# EAGLE schematic Main (EAGLE 9.6.2)
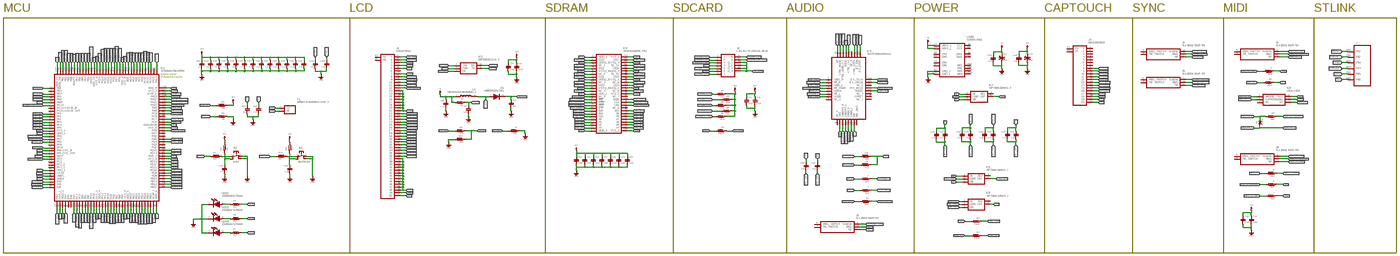
[diagram p0: schematic, sheet 1, overview]
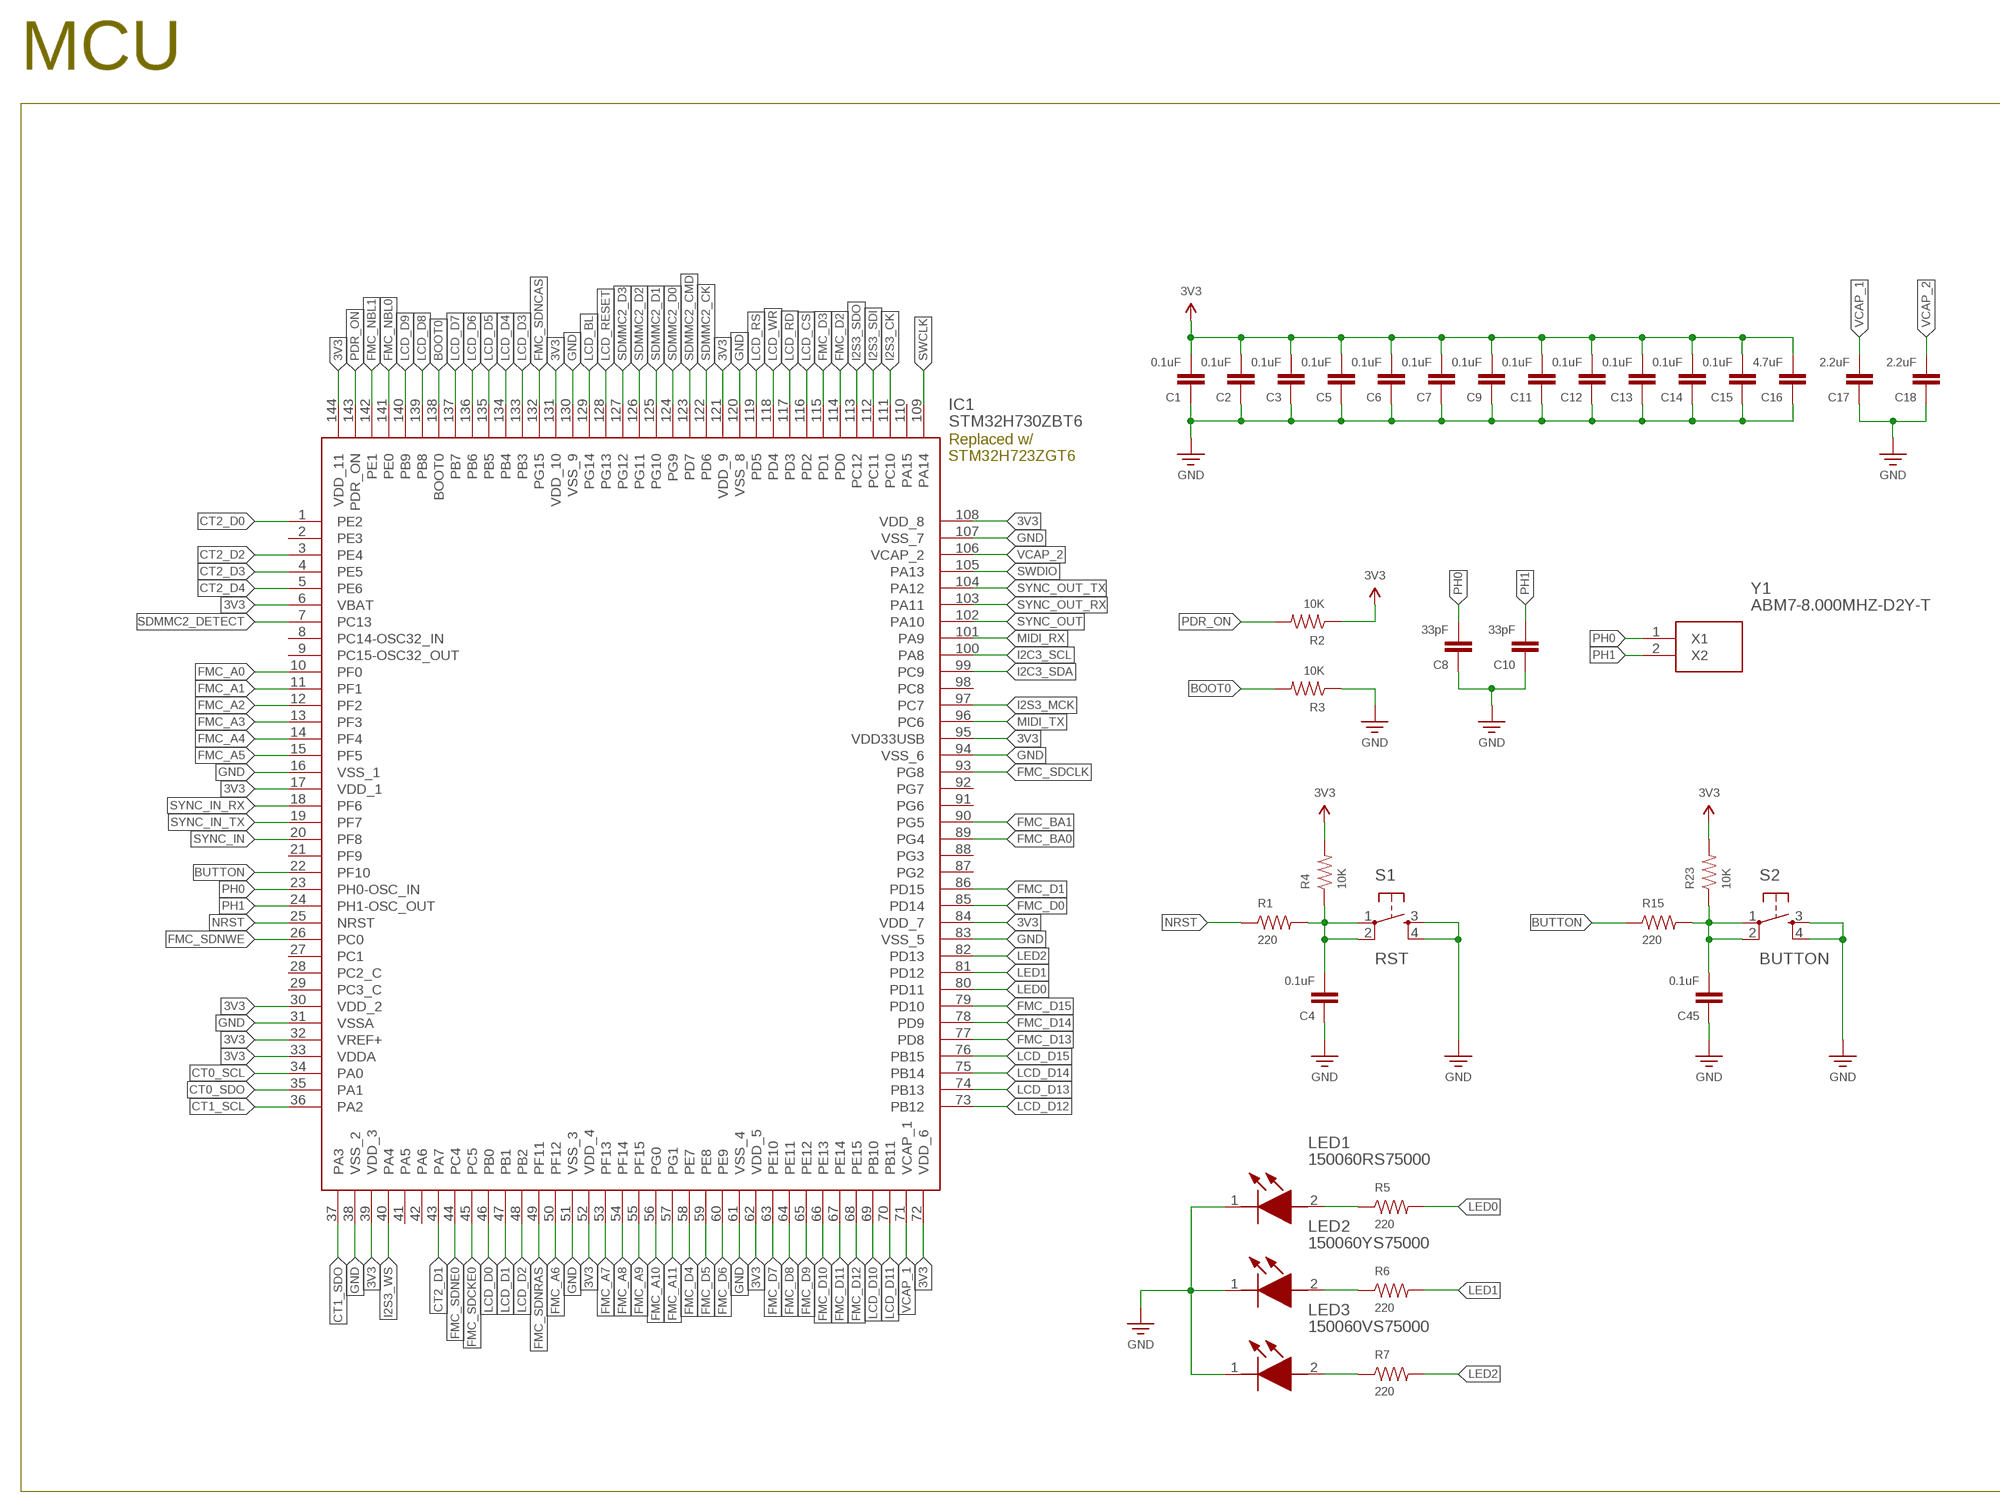
[diagram p1: schematic, sheet 1, part 1 of 4]
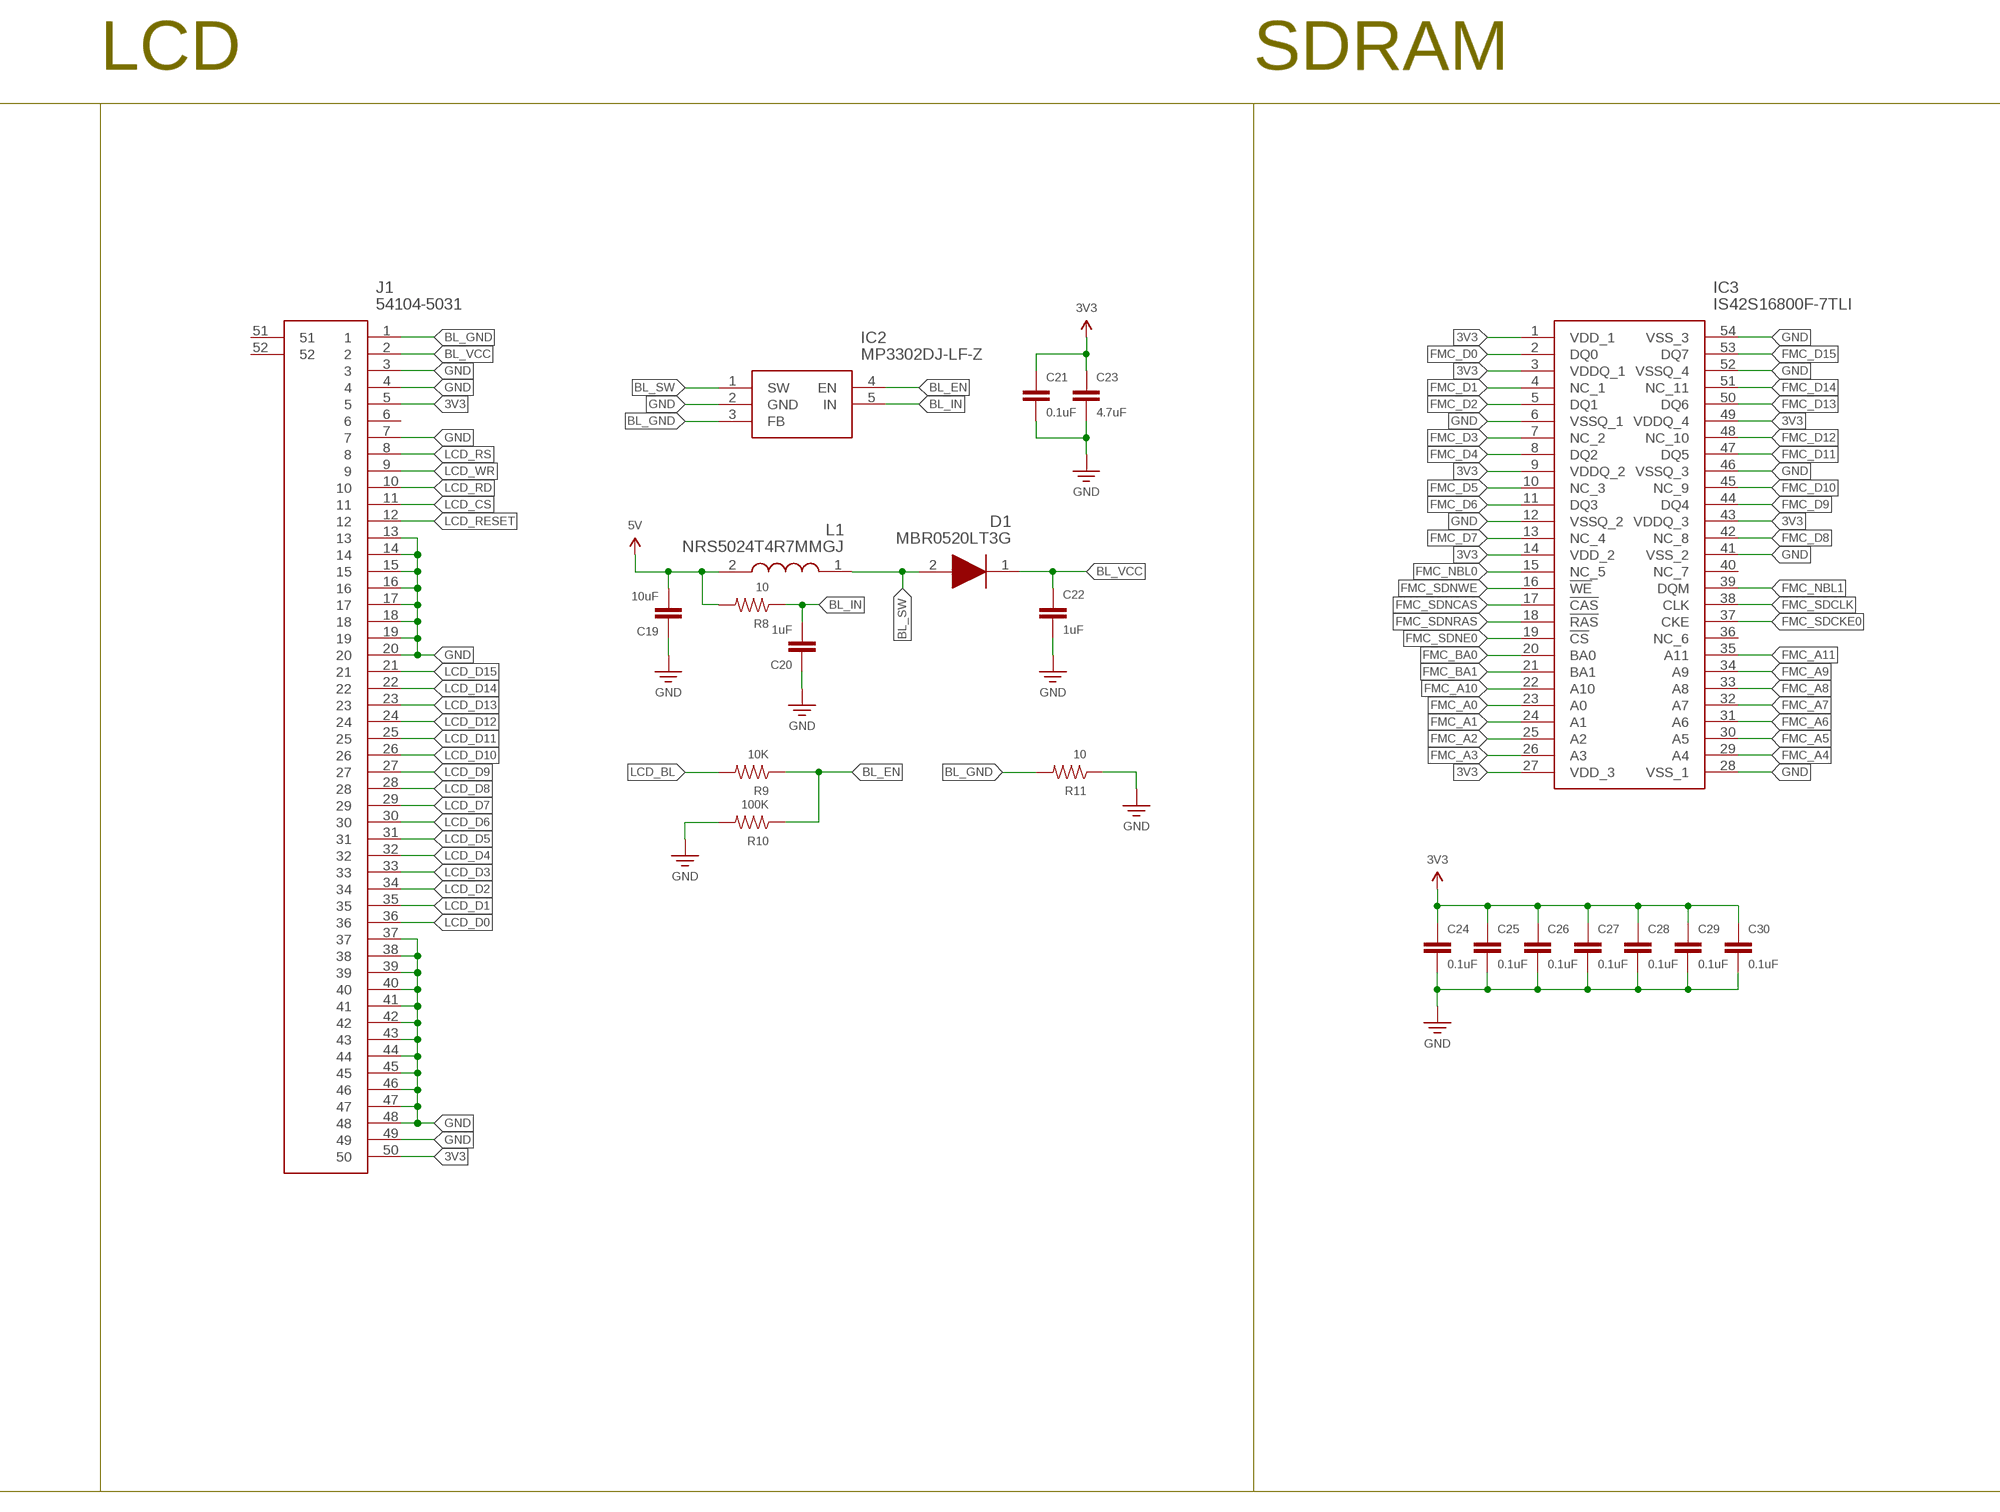
[diagram p2: schematic, sheet 1, part 2 of 4]
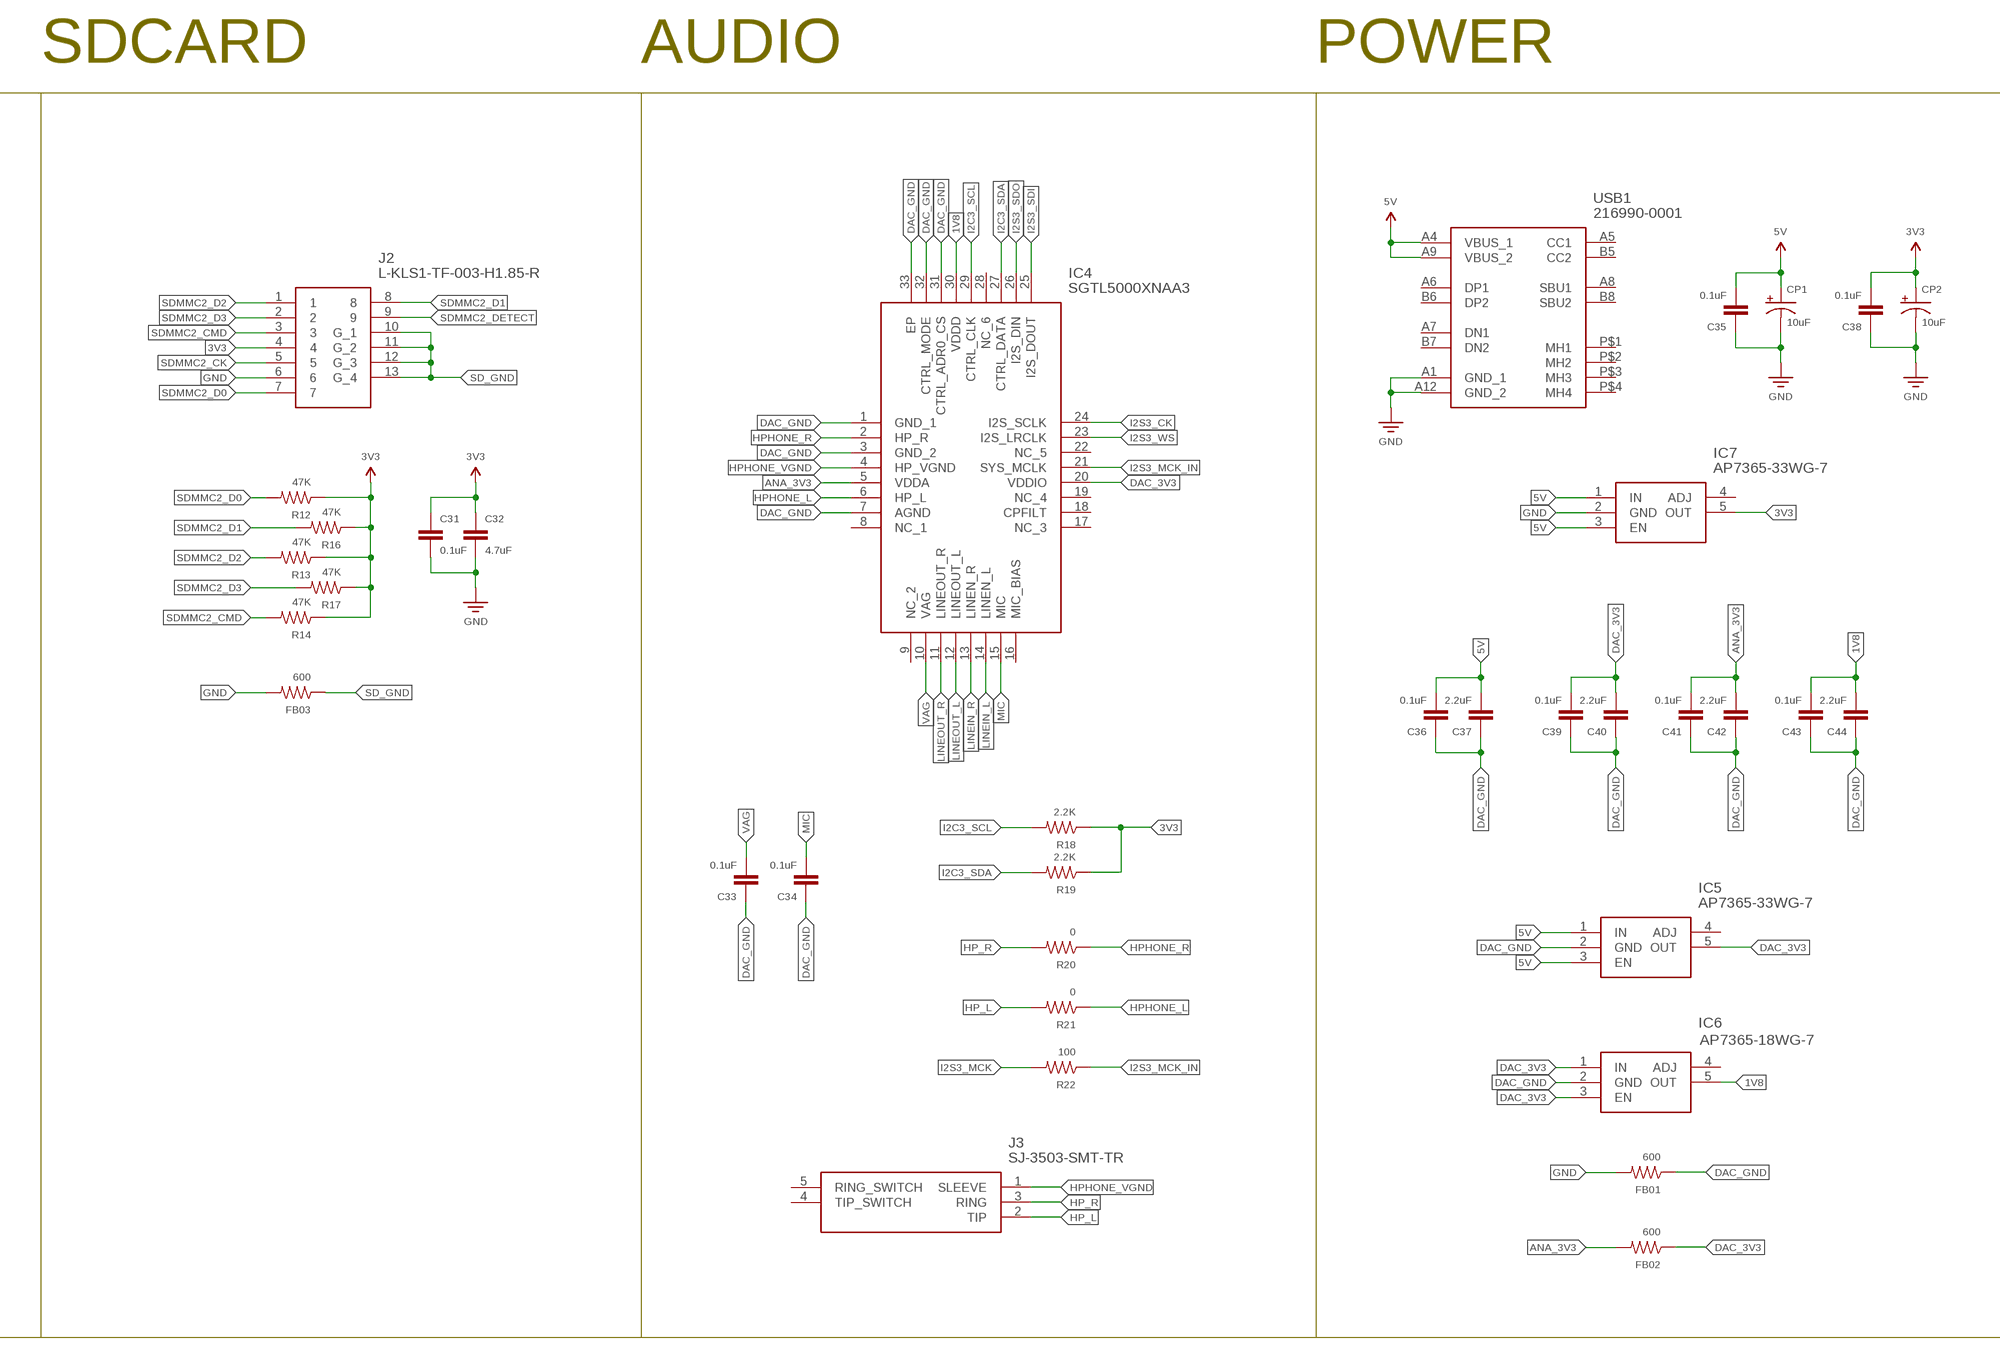
[diagram p3: schematic, sheet 1, part 3 of 4]
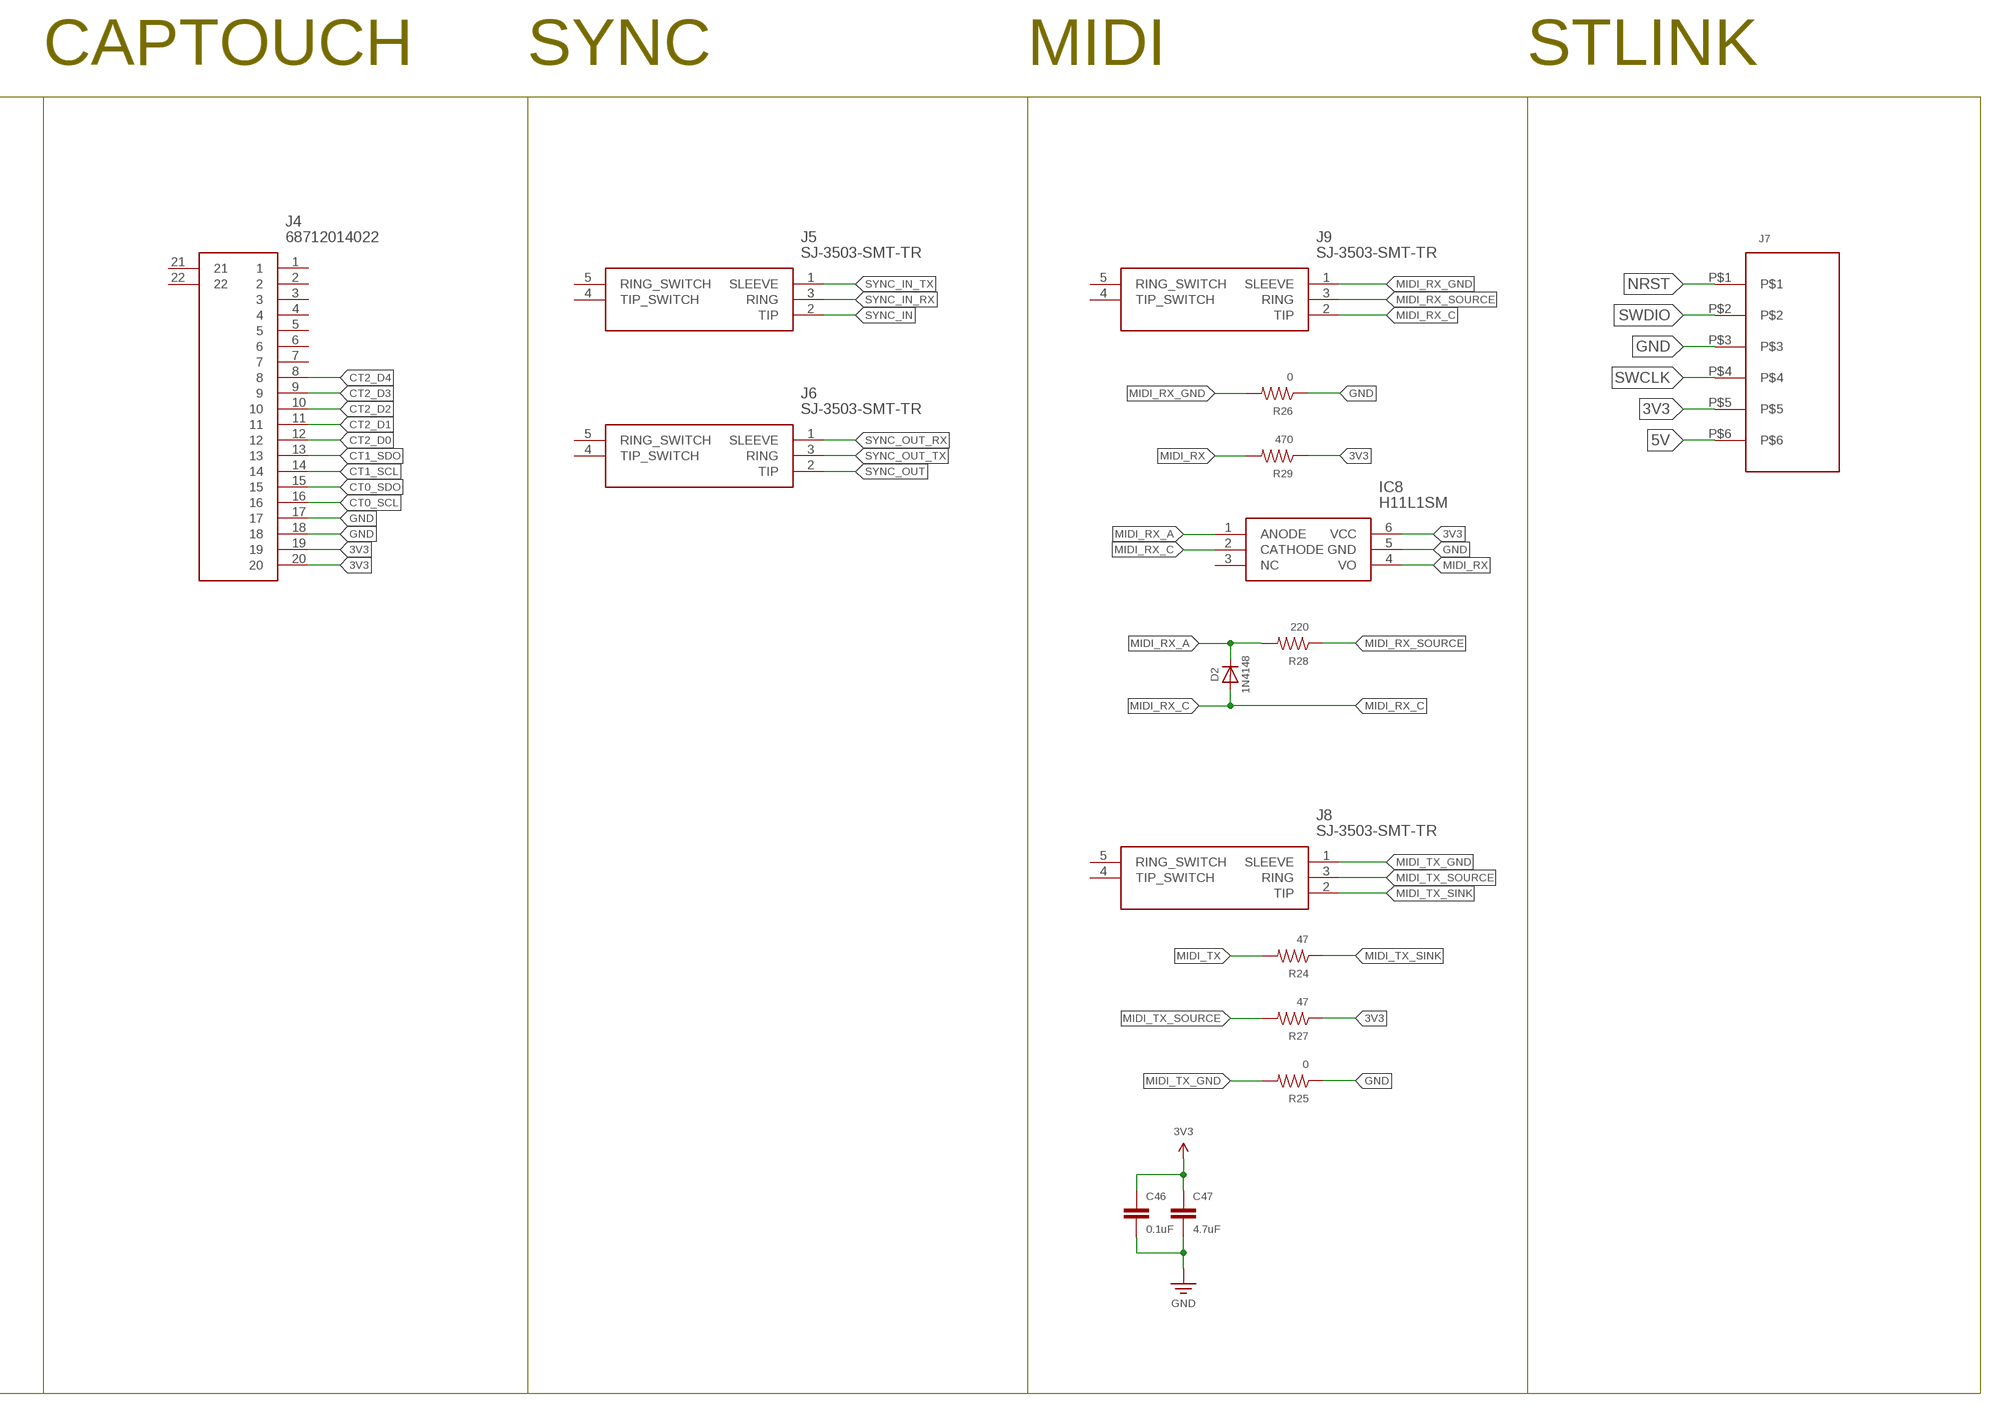
[diagram p4: schematic, sheet 1, part 4 of 4]

## Parts
C1  0.1uF  CAP-0603  [CAP-0603]
C2  0.1uF  CAP-0603  [CAP-0603]
C3  0.1uF  CAP-0603  [CAP-0603]
C4  0.1uF  CAP-0603  [CAP-0603]
C5  0.1uF  CAP-0603  [CAP-0603]
C6  0.1uF  CAP-0603  [CAP-0603]
C7  0.1uF  CAP-0603  [CAP-0603]
C8  33pF  CAP-0603  [CAP-0603]
C9  0.1uF  CAP-0603  [CAP-0603]
C10  33pF  CAP-0603  [CAP-0603]
C11  0.1uF  CAP-0603  [CAP-0603]
C12  0.1uF  CAP-0603  [CAP-0603]
C13  0.1uF  CAP-0603  [CAP-0603]
C14  0.1uF  CAP-0603  [CAP-0603]
C15  0.1uF  CAP-0603  [CAP-0603]
C16  4.7uF  CAP-0603  [CAP-0603]
C17  2.2uF  CAP-0603  [CAP-0603]
C18  2.2uF  CAP-0603  [CAP-0603]
C19  10uF  CAP-0603  [CAP-0603]
C20  1uF  CAP-0603  [CAP-0603]
C21  0.1uF  CAP-0603  [CAP-0603]
C22  1uF  CAP-0603  [CAP-0603]
C23  4.7uF  CAP-0603  [CAP-0603]
C24  0.1uF  CAP-0603  [CAP-0603]
C25  0.1uF  CAP-0603  [CAP-0603]
C26  0.1uF  CAP-0603  [CAP-0603]
C27  0.1uF  CAP-0603  [CAP-0603]
C28  0.1uF  CAP-0603  [CAP-0603]
C29  0.1uF  CAP-0603  [CAP-0603]
C30  0.1uF  CAP-0603  [CAP-0603]
C31  0.1uF  CAP-0603  [CAP-0603]
C32  4.7uF  CAP-0603  [CAP-0603]
C33  0.1uF  CAP-0603  [CAP-0603]
C34  0.1uF  CAP-0603  [CAP-0603]
C35  0.1uF  CAP-0603  [CAP-0603]
C36  0.1uF  CAP-0603  [CAP-0603]
C37  2.2uF  CAP-0603  [CAP-0603]
C38  0.1uF  CAP-0603  [CAP-0603]
C39  0.1uF  CAP-0603  [CAP-0603]
C40  2.2uF  CAP-0603  [CAP-0603]
C41  0.1uF  CAP-0603  [CAP-0603]
C42  2.2uF  CAP-0603  [CAP-0603]
C43  0.1uF  CAP-0603  [CAP-0603]
C44  2.2uF  CAP-0603  [CAP-0603]
C45  0.1uF  CAP-0603  [CAP-0603]
C46  0.1uF  CAP-0603  [CAP-0603]
C47  4.7uF  CAP-0603  [CAP-0603]
CP1  10uF  CAP-POL-1206  [CAP-POL-1206]
CP2  10uF  CAP-POL-1206  [CAP-POL-1206]
D1  MBR0520LT3G  [SOD3716X135N]
D2  1N4148  DIODESOD-323  [SOD-323]
FB01  600  RES-0603  [RES-0603]
FB02  600  RES-0603  [RES-0603]
FB03  600  RES-0603  [RES-0603]
IC1  STM32H730ZBT6  [QFP50P2200X2200X160-144N]
IC2  MP3302DJ-LF-Z  [SOT95P280X100-5N]
IC3  IS42S16800F-7TLI  [SOP80P1176X120-54N]
IC4  SGTL5000XNAA3  [QFN50P500X500X90-33N]
IC5  AP7365-33WG-7  [SOT95P285X130-5N]
IC6  AP7365-18WG-7  [SOT95P285X130-5N]
IC7  AP7365-33WG-7  [SOT95P285X130-5N]
IC8  H11L1SM  [SMT-6PIN-(LEAD-BEND)]
J1  54104-5031  [541045031]
J2  L-KLS1-TF-003-H1.85-R  [L-KLS1-TF-003-H1.85-R]
J3  SJ-3503-SMT-TR  [SJ3503SMTTR]
J4  68712014022  [68712014022]
J5  SJ-3503-SMT-TR  [SJ3503SMTTR]
J6  SJ-3503-SMT-TR  [SJ3503SMTTR]
J7  HFW6R-2STE1LF  [HFW6R-2STE1LF]
J8  SJ-3503-SMT-TR  [SJ3503SMTTR]
J9  SJ-3503-SMT-TR  [SJ3503SMTTR]
L1  NRS5024T4R7MMGJ  [NRS5024T4R7MMGJ]
LED1  150060RS75000  [LEDC1608X80N]
LED2  150060YS75000  [LEDC1608X80N]
LED3  150060VS75000  [LEDC1608X80N]
R1  220  RES-0603  [RES-0603]
R2  10K  RES-0603  [RES-0603]
R3  10K  RES-0603  [RES-0603]
R4  10K  RES-0603  [RES-0603]
R5  220  RES-0603  [RES-0603]
R6  220  RES-0603  [RES-0603]
R7  220  RES-0603  [RES-0603]
R8  10  RES-0603  [RES-0603]
R9  10K  RES-0603  [RES-0603]
R10  100K  RES-0603  [RES-0603]
R11  10  RES-0603  [RES-0603]
R12  47K  RES-0603  [RES-0603]
R13  47K  RES-0603  [RES-0603]
R14  47K  RES-0603  [RES-0603]
R15  220  RES-0603  [RES-0603]
R16  47K  RES-0603  [RES-0603]
R17  47K  RES-0603  [RES-0603]
R18  2.2K  RES-0603  [RES-0603]
R19  2.2K  RES-0603  [RES-0603]
R20  0  RES-0603  [RES-0603]
R21  0  RES-0603  [RES-0603]
R22  100  RES-0603  [RES-0603]
R23  10K  RES-0603  [RES-0603]
R24  47  RES-0603  [RES-0603]
R25  0  RES-0603  [RES-0603]
R26  0  RES-0603  [RES-0603]
R27  47  RES-0603  [RES-0603]
R28  220  RES-0603  [RES-0603]
R29  470  RES-0603  [RES-0603]
S1  RST  TAC_SWITCHSMD  [TACTILE-SWITCH-SMD]
S2  BUTTON  TAC_SWITCHSMD  [TACTILE-SWITCH-SMD]
USB1  216990-0001  [2169900001]
Y1  ABM7-8.000MHZ-D2Y-T  [ABM78000MHZD2YT]

## Nets
1V8: C43.P$2 C44.P$2 IC4.30(VDDD) IC6.5(OUT)
3V3: C1.P$2 C2.P$2 C3.P$2 C5.P$2 C6.P$2 C7.P$2 C9.P$2 C11.P$2 C12.P$2 C13.P$2 C14.P$2 C15.P$2 C16.P$2 C21.P$1 C23.P$1 C24.P$1 C25.P$1 C26.P$1 C27.P$1 C28.P$1 C29.P$1 C30.P$1 C31.P$1 C32.P$1 C38.P$2 C46.P$1 C47.P$1 CP2.P$1(+) IC1.6(VBAT) IC1.17(VDD_1) IC1.30(VDD_2) IC1.32(VREF+) IC1.33(VDDA) IC1.39(VDD_3) IC1.52(VDD_4) IC1.62(VDD_5) IC1.72(VDD_6) IC1.84(VDD_7) IC1.95(VDD33USB) IC1.108(VDD_8) IC1.121(VDD_9) IC1.131(VDD_10) IC1.144(VDD_11) IC3.1(VDD_1) IC3.3(VDDQ_1) IC3.9(VDDQ_2) IC3.14(VDD_2) IC3.27(VDD_3) IC3.43(VDDQ_3) IC3.49(VDDQ_4) IC7.5(OUT) IC8.6(VCC) J1.5 J1.50 J2.4 J4.19 J4.20 J7.P$5 R2.P$1 R4.P$2 R12.P$1 R13.P$1 R14.P$1 R16.P$1 R17.P$1 R18.P$1 R19.P$1 R23.P$2 R27.P$1 R29.P$1
5V: C19.P$2 C35.P$2 C36.P$2 C37.P$2 CP1.P$1(+) IC5.1(IN) IC5.3(EN) IC7.1(IN) IC7.3(EN) J7.P$6 L1.2 R8.P$2 USB1.A4(VBUS_1) USB1.A9(VBUS_2)
ANA_3V3: C41.P$2 C42.P$2 FB02.P$2 IC4.5(VDDA)
BL_EN: IC2.4(EN) R9.P$1 R10.P$1
BL_GND: IC2.3(FB) J1.1 R11.P$2
BL_IN: C20.P$2 IC2.5(IN) R8.P$1
BL_SW: D1.2(A) IC2.1(SW) L1.1
BL_VCC: C22.P$1 D1.1(K) J1.2
BOOT0: IC1.138(BOOT0) R3.P$2
BUTTON: IC1.22(PF10) R15.P$1
CT0_SCL: IC1.34(PA0) J4.16
CT0_SDO: IC1.35(PA1) J4.15
CT1_SCL: IC1.36(PA2) J4.14
CT1_SDO: IC1.37(PA3) J4.13
CT2_D0: IC1.1(PE2) J4.12
CT2_D1: IC1.43(PA7) J4.11
CT2_D2: IC1.3(PE4) J4.10
CT2_D3: IC1.4(PE5) J4.9
CT2_D4: IC1.5(PE6) J4.8
DAC_3V3: C39.P$2 C40.P$2 FB02.P$1 IC4.20(VDDIO) IC5.5(OUT) IC6.1(IN) IC6.3(EN)
DAC_GND: C33.P$1 C34.P$1 C36.P$1 C37.P$1 C39.P$1 C40.P$1 C41.P$1 C42.P$1 C43.P$1 C44.P$1 FB01.P$1 IC4.1(GND_1) IC4.3(GND_2) IC4.7(AGND) IC4.31(CTRL_ADR0_CS) IC4.32(CTRL_MODE) IC4.33(EP) IC5.2(GND) IC6.2(GND)
FMC_A0: IC1.10(PF0) IC3.23(A0)
FMC_A1: IC1.11(PF1) IC3.24(A1)
FMC_A2: IC1.12(PF2) IC3.25(A2)
FMC_A3: IC1.13(PF3) IC3.26(A3)
FMC_A4: IC1.14(PF4) IC3.29(A4)
FMC_A5: IC1.15(PF5) IC3.30(A5)
FMC_A6: IC1.50(PF12) IC3.31(A6)
FMC_A7: IC1.53(PF13) IC3.32(A7)
FMC_A8: IC1.54(PF14) IC3.33(A8)
FMC_A9: IC1.55(PF15) IC3.34(A9)
FMC_A10: IC1.56(PG0) IC3.22(A10)
FMC_A11: IC1.57(PG1) IC3.35(A11)
FMC_BA0: IC1.89(PG4) IC3.20(BA0)
FMC_BA1: IC1.90(PG5) IC3.21(BA1)
FMC_D0: IC1.85(PD14) IC3.2(DQ0)
FMC_D1: IC1.86(PD15) IC3.4(NC_1)
FMC_D2: IC1.114(PD0) IC3.5(DQ1)
FMC_D3: IC1.115(PD1) IC3.7(NC_2)
FMC_D4: IC1.58(PE7) IC3.8(DQ2)
FMC_D5: IC1.59(PE8) IC3.10(NC_3)
FMC_D6: IC1.60(PE9) IC3.11(DQ3)
FMC_D7: IC1.63(PE10) IC3.13(NC_4)
FMC_D8: IC1.64(PE11) IC3.42(NC_8)
FMC_D9: IC1.65(PE12) IC3.44(DQ4)
FMC_D10: IC1.66(PE13) IC3.45(NC_9)
FMC_D11: IC1.67(PE14) IC3.47(DQ5)
FMC_D12: IC1.68(PE15) IC3.48(NC_10)
FMC_D13: IC1.77(PD8) IC3.50(DQ6)
FMC_D14: IC1.78(PD9) IC3.51(NC_11)
FMC_D15: IC1.79(PD10) IC3.53(DQ7)
FMC_NBL0: IC1.141(PE0) IC3.15(NC_5)
FMC_NBL1: IC1.142(PE1) IC3.39(DQM)
FMC_SDCKE0: IC1.45(PC5) IC3.37(CKE)
FMC_SDCLK: IC1.93(PG8) IC3.38(CLK)
FMC_SDNCAS: IC1.132(PG15) IC3.17(!CAS)
FMC_SDNE0: IC1.44(PC4) IC3.19(!CS)
FMC_SDNRAS: IC1.49(PF11) IC3.18(!RAS)
FMC_SDNWE: IC1.26(PC0) IC3.16(!WE)
GND: C1.P$1 C2.P$1 C3.P$1 C4.P$1 C5.P$1 C6.P$1 C7.P$1 C8.P$1 C9.P$1 C10.P$1 C11.P$1 C12.P$1 C13.P$1 C14.P$1 C15.P$1 C16.P$1 C17.P$1 C18.P$1 C19.P$1 C20.P$1 C21.P$2 C22.P$2 C23.P$2 C24.P$2 C25.P$2 C26.P$2 C27.P$2 C28.P$2 C29.P$2 C30.P$2 C31.P$2 C32.P$2 C35.P$1 C38.P$1 C45.P$1 C46.P$2 C47.P$2 CP1.P$2(-) CP2.P$2(-) FB01.P$2 FB03.P$2 IC1.16(VSS_1) IC1.31(VSSA) IC1.38(VSS_2) IC1.51(VSS_3) IC1.61(VSS_4) IC1.83(VSS_5) IC1.94(VSS_6) IC1.107(VSS_7) IC1.120(VSS_8) IC1.130(VSS_9) IC2.2(GND) IC3.6(VSSQ_1) IC3.12(VSSQ_2) IC3.28(VSS_1) IC3.41(VSS_2) IC3.46(VSSQ_3) IC3.52(VSSQ_4) IC3.54(VSS_3) IC7.2(GND) IC8.5(GND) J1.3 J1.4 J1.7 J1.13 J1.14 J1.15 J1.16 J1.17 J1.18 J1.19 J1.20 J1.37 J1.38 J1.39 J1.40 J1.41 J1.42 J1.43 J1.44 J1.45 J1.46 J1.47 J1.48 J1.49 J2.6 J4.17 J4.18 J7.P$3 LED1.1(K) LED2.1(K) LED3.1(K) R3.P$1 R10.P$2 R11.P$1 R25.P$1 R26.P$1 S1.3 S1.4 S2.3 S2.4 USB1.A1(GND_1) USB1.A12(GND_2)
HP_L: J3.2(TIP) R21.P$2
HP_R: J3.3(RING) R20.P$2
HPHONE_L: IC4.6(HP_L) R21.P$1
HPHONE_R: IC4.2(HP_R) R20.P$1
HPHONE_VGND: IC4.4(HP_VGND) J3.1(SLEEVE)
I2C3_SCL: IC1.100(PA8) IC4.29(CTRL_CLK) R18.P$2
I2C3_SDA: IC1.99(PC9) IC4.27(CTRL_DATA) R19.P$2
I2S3_CK: IC1.111(PC10) IC4.24(I2S_SCLK)
I2S3_MCK: IC1.97(PC7) R22.P$2
I2S3_MCK_IN: IC4.21(SYS_MCLK) R22.P$1
I2S3_SDI: IC1.112(PC11) IC4.25(I2S_DOUT)
I2S3_SDO: IC1.113(PC12) IC4.26(I2S_DIN)
I2S3_WS: IC1.40(PA4) IC4.23(I2S_LRCLK)
LCD_BL: IC1.129(PG14) R9.P$2
LCD_CS: IC1.116(PD2) J1.11
LCD_D0: IC1.46(PB0) J1.36
LCD_D1: IC1.47(PB1) J1.35
LCD_D2: IC1.48(PB2) J1.34
LCD_D3: IC1.133(PB3) J1.33
LCD_D4: IC1.134(PB4) J1.32
LCD_D5: IC1.135(PB5) J1.31
LCD_D6: IC1.136(PB6) J1.30
LCD_D7: IC1.137(PB7) J1.29
LCD_D8: IC1.139(PB8) J1.28
LCD_D9: IC1.140(PB9) J1.27
LCD_D10: IC1.69(PB10) J1.26
LCD_D11: IC1.70(PB11) J1.25
LCD_D12: IC1.73(PB12) J1.24
LCD_D13: IC1.74(PB13) J1.23
LCD_D14: IC1.75(PB14) J1.22
LCD_D15: IC1.76(PB15) J1.21
LCD_RD: IC1.117(PD3) J1.10
LCD_RESET: IC1.128(PG13) J1.12
LCD_RS: IC1.119(PD5) J1.8
LCD_WR: IC1.118(PD4) J1.9
LED0: IC1.80(PD11) R5.P$2
LED1: IC1.81(PD12) R6.P$2
LED2: IC1.82(PD13) R7.P$2
LINEIN_L: IC4.14(LINEN_L)
LINEIN_R: IC4.13(LINEN_R)
LINEOUT_L: IC4.12(LINEOUT_L)
LINEOUT_R: IC4.11(LINEOUT_R)
MIC: C34.P$2 IC4.15(MIC)
MIDI_RX: IC1.101(PA9) IC8.4(VO) R29.P$2
MIDI_RX_A: D2.C IC8.1(ANODE) R28.P$2
MIDI_RX_C: D2.A IC8.2(CATHODE) J9.2(TIP)
MIDI_RX_GND: J9.1(SLEEVE) R26.P$2
MIDI_RX_SOURCE: J9.3(RING) R28.P$1
MIDI_TX: IC1.96(PC6) R24.P$2
MIDI_TX_GND: J8.1(SLEEVE) R25.P$2
MIDI_TX_SINK: J8.2(TIP) R24.P$1
MIDI_TX_SOURCE: J8.3(RING) R27.P$2
N$2: C45.P$2 R15.P$2 R23.P$1 S2.1 S2.2
N$4: C4.P$2 R1.P$2 R4.P$1 S1.1 S1.2
N$7: LED1.2(A) R5.P$1
N$9: LED2.2(A) R6.P$1
N$10: LED3.2(A) R7.P$1
NRST: IC1.25(NRST) J7.P$1 R1.P$1
PDR_ON: IC1.143(PDR_ON) R2.P$2
PH0: C8.P$2 IC1.23(PH0-OSC_IN) Y1.1(X1)
PH1: C10.P$2 IC1.24(PH1-OSC_OUT) Y1.2(X2)
SD_GND: FB03.P$1 J2.10(G_1) J2.11(G_2) J2.12(G_3) J2.13(G_4)
SDMMC2_CK: IC1.122(PD6) J2.5
SDMMC2_CMD: IC1.123(PD7) J2.3 R14.P$2
SDMMC2_D0: IC1.124(PG9) J2.7 R12.P$2
SDMMC2_D1: IC1.125(PG10) J2.8 R16.P$2
SDMMC2_D2: IC1.126(PG11) J2.1 R13.P$2
SDMMC2_D3: IC1.127(PG12) J2.2 R17.P$2
SDMMC2_DETECT: IC1.7(PC13) J2.9
SWCLK: IC1.109(PA14) J7.P$4
SWDIO: IC1.105(PA13) J7.P$2
SYNC_IN: IC1.20(PF8) J5.2(TIP)
SYNC_IN_RX: IC1.18(PF6) J5.3(RING)
SYNC_IN_TX: IC1.19(PF7) J5.1(SLEEVE)
SYNC_OUT: IC1.102(PA10) J6.2(TIP)
SYNC_OUT_RX: IC1.103(PA11) J6.1(SLEEVE)
SYNC_OUT_TX: IC1.104(PA12) J6.3(RING)
VAG: C33.P$2 IC4.10(VAG)
VCAP_1: C17.P$2 IC1.71(VCAP_1)
VCAP_2: C18.P$2 IC1.106(VCAP_2)
Unconnected: IC1.2(PE3) IC1.8(PC14-OSC32_IN) IC1.9(PC15-OSC32_OUT) IC1.21(PF9) IC1.27(PC1) IC1.28(PC2_C) IC1.29(PC3_C) IC1.41(PA5) IC1.42(PA6) IC1.87(PG2) IC1.88(PG3) IC1.91(PG6) IC1.92(PG7) IC1.98(PC8) IC1.110(PA15) IC3.36(NC_6) IC3.40(NC_7) IC4.8(NC_1) IC4.9(NC_2) IC4.16(MIC_BIAS) IC4.17(NC_3) IC4.18(CPFILT) IC4.19(NC_4) IC4.22(NC_5) IC4.28(NC_6) IC5.4(ADJ) IC6.4(ADJ) IC7.4(ADJ) IC8.3(NC) J1.6 J1.51 J1.52 J3.4(TIP_SWITCH) J3.5(RING_SWITCH) J4.1 J4.2 J4.3 J4.4 J4.5 J4.6 J4.7 J4.21 J4.22 J5.4(TIP_SWITCH) J5.5(RING_SWITCH) J6.4(TIP_SWITCH) J6.5(RING_SWITCH) J8.4(TIP_SWITCH) J8.5(RING_SWITCH) J9.4(TIP_SWITCH) J9.5(RING_SWITCH) USB1.A5(CC1) USB1.A6(DP1) USB1.A7(DN1) USB1.A8(SBU1) USB1.B5(CC2) USB1.B6(DP2) USB1.B7(DN2) USB1.B8(SBU2) USB1.P$1(MH1) USB1.P$2(MH2) USB1.P$3(MH3) USB1.P$4(MH4)

## Notes on the sheet
- MCU | LCD | SDRAM | SDCARD | AUDIO | POWER | CAPTOUCH | SYNC | MIDI | STLINK
- Replaced w/ 
  STM32H723ZGT6
- AP7365-18WG-7

## Library data of the parts
C1-C47 = Capacitor:CAP-0603
CP1 CP2 = Capacitor:CAP-POL-1206
D1 = RandomWaves:MBR0520LT3G: ON SEMICONDUCTOR - MBR0520LT3G - RECTIFIER, SCHOTTKY, 0.5A, 20V, SOD-123 Source: Datasheet <http://www.onsemi.com/pub/Collateral/MBR0520LT1-D.PDF>; ARROW_PART_NUMBER: MBR0520LT3G; ARROW_PRICE-STOCK: https://www.arrow.com/en/products/mbr0520lt3g/on-semiconductor; DESCRIPTION: ON SEMICONDUCTOR - MBR0520LT3G - RECTIFIER, SCHOTTKY, 0.5A, 20V, SOD-123; HEIGHT: 1.35mm; MANUFACTURER_NAME: ON Semiconductor; MANUFACTURER_PART_NUMBER: MBR0520LT3G; MOUSER_PART_NUMBER: 863-MBR0520LT3G; MOUSER_PRICE-STOCK: https://www.mouser.co.uk/ProductDetail/ON-Semiconductor/MBR0520LT3G?qs=3JMERSakebrHITezQJBmeQ%3D%3D
D2 = microbuilder:DIODE: Diode SMA Model Volts Amps Type Vf Ir Digikey # Notes SSA34-E3 40V 3A Schottky 480mV @ 3A 200uA @ 40V SSA34-E3/61TGITR-ND CDBA120-G 20V 1A Schottky 500mV @ 1A 500uA @ 20V 641-1014-6-ND REEL MBRA210 10V 2A Schottky 350mV @ 2A 700uA @ 10V MBRA210LT3 SOD-123 Model Volts Amps Type Vf Ir Order # Notes BAT54T1G 30V 200mA Schottky 800mV @ 200mA 2uA @ 25V BAT54T1GOSTR-ND B0530W 30V 500mA Schottky 430mV @ 500mA 130uA @ 30V B0530W-FDICT-ND REEL MBR120 20V 1A Schottky 340mV @ 1A MBR120VLSFT1GOSCT-ND SOD-323 Model Volts Amps Type Vf Ir Order # Notes PMEG2005EJ 20V 500mA Schottky 355mV @ 500mA 568-4110-1-ND ZLLS410 10V 570mA Schottky 380mV @ 570mA ZLLS410CT-ND 1N4148WS 75V 150mA Silicon/Simple 1V 1N4148WSFSCT-ND REEL SOD-523 Model Volts Amps Type Vf Ir Order # Notes BAT54XV2 30V 200mA Schottky 0.8V @ 100mA BAT54XV2CT-ND TB751S 30V 30mA Schottky RB751S-40TE61CT-ND SOT23-R/W (R = Solder Paste/Reflow Ovens, W = Hand-Soldering) Model Volts Amps Type Vf Ir Order # Notes BAT54FILM 40V 300mA Schottky 497-7162-1-ND POWERDI-5 Model Volts Amps Type Vf Ir Order # Notes PDS560 60V 5A Schottky 670mV @ 5A 150uA @ 60V PDS560DICT-ND
FB01-FB03 R1-R29 = Resistor:RES-0603
IC1 = RandomWaves:STM32H730ZBT6: ARM Microcontrollers - MCU 16/32-BITS MICROS Source: Datasheet <https://www.mouser.com/datasheet/2/389/stm32h730ab-1893362.pdf>; ARROW_PART_NUMBER: STM32H730ZBT6; ARROW_PRICE-STOCK: https://www.arrow.com/en/products/stm32h730zbt6/stmicroelectronics; DESCRIPTION: ARM Microcontrollers - MCU 16/32-BITS MICROS; HEIGHT: 1.6mm; MANUFACTURER_NAME: STMicroelectronics; MANUFACTURER_PART_NUMBER: STM32H730ZBT6; MOUSER_PART_NUMBER: 511-STM32H730ZBT6; MOUSER_PRICE-STOCK: https://www.mouser.co.uk/ProductDetail/STMicroelectronics/STM32H730ZBT6?qs=sPbYRqrBIVmvhxoKLsCUVw%3D%3D
IC2 = RandomWaves:MP3302DJ-LF-Z: LED Lighting Drivers 1.3A, 1.3MHz WLED Driver Source: Datasheet <https://componentsearchengine.com/Datasheets/1/MP3302DJ-LF-Z.pdf>; DESCRIPTION: LED Lighting Drivers 1.3A, 1.3MHz WLED Driver; HEIGHT: 1mm; MANUFACTURER_NAME: Monolithic Power Systems (MPS); MANUFACTURER_PART_NUMBER: MP3302DJ-LF-Z; MOUSER_PART_NUMBER: 946-MP3302DJLFZ; MOUSER_PRICE-STOCK: https://www.mouser.co.uk/ProductDetail/Monolithic-Power-Systems-MPS/MP3302DJ-LF-Z?qs=rC7bBWoQAAmgkwFvMFHCAg%3D%3D
IC3 = RandomWaves:IS42S16800F-7TLI: DRAM 128M, 3.3V, SDRAM, 8Mx16, 143Mhz, 54 pin TSOP II (400 mil) RoHS, IT Source: Datasheet <https://datasheet.lcsc.com/szlcsc/Integrated-Silicon-Solution-ISSI-IS42S16800F-7TLI_C69411.pdf>; ARROW_PART_NUMBER: IS42S16800F-7TLI; ARROW_PRICE-STOCK: https://www.arrow.com/en/products/is42s16800f-7tli/integrated-silicon-solution-inc; DESCRIPTION: DRAM 128M, 3.3V, SDRAM, 8Mx16, 143Mhz, 54 pin TSOP II (400 mil) RoHS, IT; HEIGHT: 1.2mm; MANUFACTURER_NAME: Integrated Silicon Solution Inc.; MANUFACTURER_PART_NUMBER: IS42S16800F-7TLI; MOUSER_PART_NUMBER: 870-IS42S16800F-7TLI; MOUSER_PRICE-STOCK: https://www.mouser.co.uk/ProductDetail/ISSI/IS42S16800F-7TLI?qs=DfG0HhEx1UWqxa76yijZ5Q%3D%3D
IC4 = RandomWaves:SGTL5000XNAA3: NXP, Audio Codec Stereo Audio 2-channel 24bit- 96kHz Serial-I2C, Serial-SPI 32-Pin QFN Source: Datasheet <http://www.nxp.com/docs/en/data-sheet/SGTL5000.pdf>; ARROW_PART_NUMBER: SGTL5000XNAA3; ARROW_PRICE-STOCK: https://www.arrow.com/en/products/sgtl5000xnaa3/nxp-semiconductors; DESCRIPTION: NXP, Audio Codec Stereo Audio 2-channel 24bit- 96kHz Serial-I2C, Serial-SPI 32-Pin QFN; HEIGHT: 0.9mm; MANUFACTURER_NAME: NXP; MANUFACTURER_PART_NUMBER: SGTL5000XNAA3; MOUSER_PART_NUMBER: 841-SGTL5000XNAA3; MOUSER_PRICE-STOCK: https://www.mouser.co.uk/ProductDetail/NXP-Semiconductors/SGTL5000XNAA3?qs=g5o6z0NmdpQ52bnp6yi7dA%3D%3D
IC5 IC7 = RandomWaves:AP7365-33WG-7: DiodesZetex AP7365-33WG-7, LDO Voltage Regulator, 600mA, 3.3 V +/-2%, 2 6 Vin, 5-Pin SOT-25 Source: Datasheet <https://componentsearchengine.com/Datasheets/1/AP7365-33WG-7.pdf>; ARROW_PART_NUMBER: AP7365-33WG-7; ARROW_PRICE-STOCK: https://www.arrow.com/en/products/ap7365-33wg-7/diodes-incorporated; DESCRIPTION: DiodesZetex AP7365-33WG-7, LDO Voltage Regulator, 600mA, 3.3 V +/-2%, 2 6 Vin, 5-Pin SOT-25; HEIGHT: 1.3mm; MANUFACTURER_NAME: Diodes Inc.; MANUFACTURER_PART_NUMBER: AP7365-33WG-7; MOUSER_PART_NUMBER: 621-AP7365-33WG-7; MOUSER_PRICE-STOCK: https://www.mouser.co.uk/ProductDetail/Diodes-Incorporated/AP7365-33WG-7?qs=abZ1nkZpTuOZFvxvoFPL0w%3D%3D
IC6 = RandomWaves:AP7365-18WG-7: DiodesZetex AP7365-18WG-7, LDO Voltage Regulator, 600mA, 1.8 V +/-2%, 2 6 Vin, 5-Pin SOT-25 Source: Datasheet <https://componentsearchengine.com/Datasheets/1/AP7365-18WG-7.pdf>; ARROW_PART_NUMBER: AP7365-33WG-7; ARROW_PRICE-STOCK: https://www.arrow.com/en/products/ap7365-33wg-7/diodes-incorporated; DESCRIPTION: DiodesZetex AP7365-33WG-7, LDO Voltage Regulator, 600mA, 3.3 V +/-2%, 2 6 Vin, 5-Pin SOT-25; HEIGHT: 1.3mm; MANUFACTURER_NAME: Diodes Inc.; MANUFACTURER_PART_NUMBER: AP7365-33WG-7; MOUSER_PART_NUMBER: 621-AP7365-33WG-7; MOUSER_PRICE-STOCK: https://www.mouser.co.uk/ProductDetail/Diodes-Incorporated/AP7365-33WG-7?qs=abZ1nkZpTuOZFvxvoFPL0w%3D%3D
IC8 = H11L1SM:H11L1SM: 6-Pin DIP Schmitt Trigger Output Optocoupler Source: Datasheet <https://www.onsemi.com/pub/Collateral/H11L3M-D.PDF>; DESCRIPTION: 6-Pin DIP Schmitt Trigger Output Optocoupler; HEIGHT: mm; MANUFACTURER_NAME: onsemi; MANUFACTURER_PART_NUMBER: H11L1SM; MOUSER_PART_NUMBER: 512-H11L1SM; MOUSER_PRICE-STOCK: https://www.mouser.co.uk/ProductDetail/onsemi-Fairchild/H11L1SM?qs=9h%252BT%2FFFCxR8rbqOmNiGmNQ%3D%3D
J1 = RandomWaves:54104-5031: Connector 0.5mm, FFC/FPC, SMT,r/a,50w,Au Molex FFC/FPC SMT Series 0.5mm Pitch 50 Way Right Angle SMT Female FPC Connector, ZIF Top Contact Source: Datasheet <http://www.molex.com/webdocs/datasheets/pdf/en-us//0541045031_FFC_FPC_CONNECTORS.pdf>; DESCRIPTION: Connector 0.5mm, FFC/FPC, SMT,r/a,50w,Au Molex FFC/FPC SMT Series 0.5mm Pitch 50 Way Right Angle SMT Female FPC Connector, ZIF Top Contact; HEIGHT: 2mm; MANUFACTURER_NAME: Molex; MANUFACTURER_PART_NUMBER: 54104-5031; MOUSER_PART_NUMBER: 538-54104-5031; MOUSER_PRICE-STOCK: https://www.mouser.co.uk/ProductDetail/Molex/54104-5031?qs=DhjuHb%2FCp77H1MDxVRM4ew%3D%3D
J2 = RandomWaves:L-KLS1-TF-003-H1.85-R: Micro SD Card Connector Source: Datasheet <https://img.ozdisan.com/ETicaret_Dosya/476392_7149645.pdf>; DESCRIPTION: Micro SD Card Connector; HEIGHT: mm; MANUFACTURER_NAME: KLS Electronic; MANUFACTURER_PART_NUMBER: L-KLS1-TF-003-H1.85-R
J3 J5 J6 J8 J9 = RandomWaves:SJ-3503-SMT-TR: CONN JACK STEREO 3.5MM SMD R/A Source: Datasheet <https://cz.mouser.com/datasheet/2/670/sj_3503_smt_tr-1779259.pdf>; ARROW_PART_NUMBER: SJ-3503-SMT-TR; ARROW_PRICE-STOCK: https://www.arrow.com/en/products/sj-3503-smt-tr/cui-devices?region=nac; DESCRIPTION: CONN JACK STEREO 3.5MM SMD R/A; HEIGHT: 5.8mm; MANUFACTURER_NAME: CUI Inc.; MANUFACTURER_PART_NUMBER: SJ-3503-SMT-TR; MOUSER_PART_NUMBER: 490-SJ-3503-SMT-TR; MOUSER_PRICE-STOCK: https://www.mouser.co.uk/ProductDetail/CUI-Devices/SJ-3503-SMT-TR?qs=WyjlAZoYn52oLXthlnPPpw%3D%3D
J4 = RandomWaves:68712014022: Wurth Elektronik 687 Series 0.5mm 20 Way 1 Row Straight PCB Socket Surface Mount Wire to Board Source: Datasheet <https://katalog.we-online.de/em/datasheet/6871xx14022.pdf>; DESCRIPTION: Wurth Elektronik 687 Series 0.5mm 20 Way 1 Row Straight PCB Socket Surface Mount Wire to Board; HEIGHT: 2.1mm; MANUFACTURER_NAME: Wurth Elektronik; MANUFACTURER_PART_NUMBER: 68712014022; MOUSER_PART_NUMBER: 710-68712014022; MOUSER_PRICE-STOCK: https://www.mouser.co.uk/ProductDetail/Wurth-Elektronik/68712014022?qs=ZtY9WdtwX57%2F0bEhtjzEjA%3D%3D
J7 = HFW6R-2STE1LF:HFW6R-2STE1LF
L1 = RandomWaves:NRS5024T4R7MMGJ: Inductor Power Shielded Wirewound 4.7uH 20% 100KHz Ferrite 2A 0.066Ohm DCR T/R Source: Datasheet <https://ds.yuden.co.jp/TYCOMPAS/ut/download?pn=NRH2412T4R7MNGH &fileType=CA>; ARROW_PART_NUMBER: NRS5024T4R7MMGJ; ARROW_PRICE-STOCK: https://www.arrow.com/en/products/nrs5024t4r7mmgj/taiyo-yuden; DESCRIPTION: Inductor Power Shielded Wirewound 4.7uH 20% 100KHz Ferrite 2A 0.066Ohm DCR T/R; HEIGHT: 2.4mm; MANUFACTURER_NAME: TAIYO YUDEN; MANUFACTURER_PART_NUMBER: NRS5024T4R7MMGJ; MOUSER_PART_NUMBER: 963-NRS5024T4R7MMGJ; MOUSER_PRICE-STOCK: https://www.mouser.co.uk/ProductDetail/Taiyo-Yuden/NRS5024T4R7MMGJ?qs=vF%252B8ahGVilffmVxWIbH5HQ%3D%3D
LED1 = RandomWaves:150060RS75000: WURTH ELEKTRONIK - 150060RS75000 - LED, 0603, RED, 250MCD, 625NM Source: Datasheet <http://katalog.we-online.de/led/datasheet/150060RS75000.pdf>; DESCRIPTION: WURTH ELEKTRONIK - 150060RS75000 - LED, 0603, RED, 250MCD, 625NM; HEIGHT: 0.8mm; MANUFACTURER_NAME: Wurth Elektronik; MANUFACTURER_PART_NUMBER: 150060RS75000; MOUSER_PART_NUMBER: 710-150060RS75000; MOUSER_PRICE-STOCK: https://www.mouser.co.uk/ProductDetail/Wurth-Elektronik/150060RS75000?qs=LlUlMxKIyB3QnmZ3fw%2FVCA%3D%3D
LED2 = RandomWaves:150060YS75000: LED,Wurth Elektronik,150060YS75000 Wurth Elektronik 150060YS75000, WL-SMCW Series Yellow LED, 590 nm, 1608 (0603) Clear, Rectangle Lens SMD Package Source: Datasheet <http://uk.rs-online.com/web/p/products/8154219>; DESCRIPTION: LED,Wurth Elektronik,150060YS75000 Wurth Elektronik 150060YS75000, WL-SMCW Series Yellow LED, 590 nm, 1608 (0603) Clear, Rectangle Lens SMD Package; HEIGHT: 0.8mm; MANUFACTURER_NAME: Wurth Elektronik; MANUFACTURER_PART_NUMBER: 150060YS75000; MOUSER_PART_NUMBER: 710-150060YS75000; MOUSER_PRICE-STOCK: https://www.mouser.co.uk/ProductDetail/Wurth-Elektronik/150060YS75000?qs=LlUlMxKIyB0nKmwefHgtZw%3D%3D
LED3 = RandomWaves:150060VS75000: 2.4 V Green LED 1608 (0603) SMD, Wurth Elektronik WL-SMCW 150060VS75000 Source: Datasheet <https://componentsearchengine.com/Datasheets/2/150060VS75000.pdf>; DESCRIPTION: 2.4 V Green LED 1608 (0603) SMD, Wurth Elektronik WL-SMCW 150060VS75000; HEIGHT: 0.8mm; MANUFACTURER_NAME: Wurth Elektronik; MANUFACTURER_PART_NUMBER: 150060VS75000; MOUSER_PART_NUMBER: 710-150060VS75000; MOUSER_PRICE-STOCK: https://www.mouser.co.uk/ProductDetail/Wurth-Elektronik/150060VS75000?qs=LlUlMxKIyB1Q1Bi5mQ%2FKLw%3D%3D
S1 S2 = SparkFun-Electromechanical:TAC_SWITCH: Momentary Switch Button commonly used for reset or general input. Spark Fun Electronics SKU : COM-00097 SMT- SWCH-08247; PROD_ID: SWCH-08247; VALUE: TAC_SWITCHSMD
USB1 = RandomWaves:216990-0001: MOLEX - 216990-0001 - USB Connector, USB Type C, USB 2.0, Receptacle, 16 Ways, Surface Mount, Right Angle{0000} Source: Datasheet <https://www.molex.com/pdm_docs/sd/2169900001_sd.pdf>; DESCRIPTION: MOLEX - 216990-0001 - USB Connector, USB Type C, USB 2.0, Receptacle, 16 Ways, Surface Mount, Right Angle{0000}; HEIGHT: 3.36mm; MANUFACTURER_NAME: Molex; MANUFACTURER_PART_NUMBER: 216990-0001; MOUSER_PART_NUMBER: 538-216990-0001; MOUSER_PRICE-STOCK: https://www.mouser.co.uk/ProductDetail/Molex/216990-0001?qs=DRkmTr78QAS%252B9wQ3YlpV3Q%3D%3D
Y1 = RandomWaves:ABM7-8.000MHZ-D2Y-T: ABRACON - ABM7-8.000MHZ-D2Y-T - CRYSTAL, 8MHZ, 18PF, SMD Source: Datasheet <http://www.abracon.com/Resonators/abm7.pdf>; ARROW_PART_NUMBER: ABM7-8.000MHZ-D2Y-T; ARROW_PRICE-STOCK: https://www.arrow.com/en/products/abm7-8.000mhz-d2y-t/abracon; DESCRIPTION: ABRACON - ABM7-8.000MHZ-D2Y-T - CRYSTAL, 8MHZ, 18PF, SMD; HEIGHT: 1.4mm; MANUFACTURER_NAME: ABRACON; MANUFACTURER_PART_NUMBER: ABM7-8.000MHZ-D2Y-T; MOUSER_PART_NUMBER: 815-ABM7-8-D2Y-T; MOUSER_PRICE-STOCK: https://www.mouser.co.uk/ProductDetail/ABRACON/ABM7-8000MHZ-D2Y-T?qs=LoTOQoUkC8SFsmY8snleBA%3D%3D